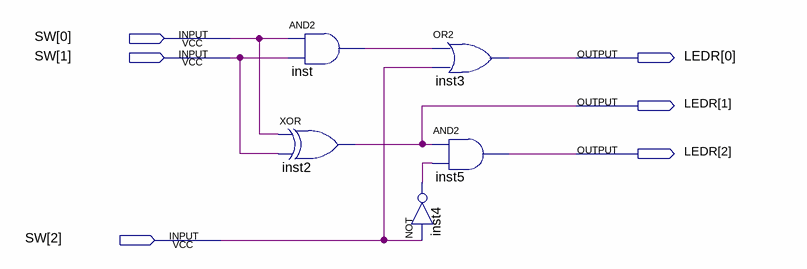
[diagram p0: schematic sheet]
// Quartus schematic Block2.bdf as structural Verilog: 5 symbols, 6 pins
module Block2 (
  input  [2:0] SW,
  output [2:0] LEDR
);

  wire inst4_out, inst_out;

  and inst (inst_out, SW[0], SW[1]);
  xor inst2 (LEDR[1], SW[0], SW[1]);
  or inst3 (LEDR[0], inst_out, SW[2]);
  and inst5 (LEDR[2], LEDR[1], inst4_out);
  not inst4 (inst4_out, SW[2]);
endmodule
